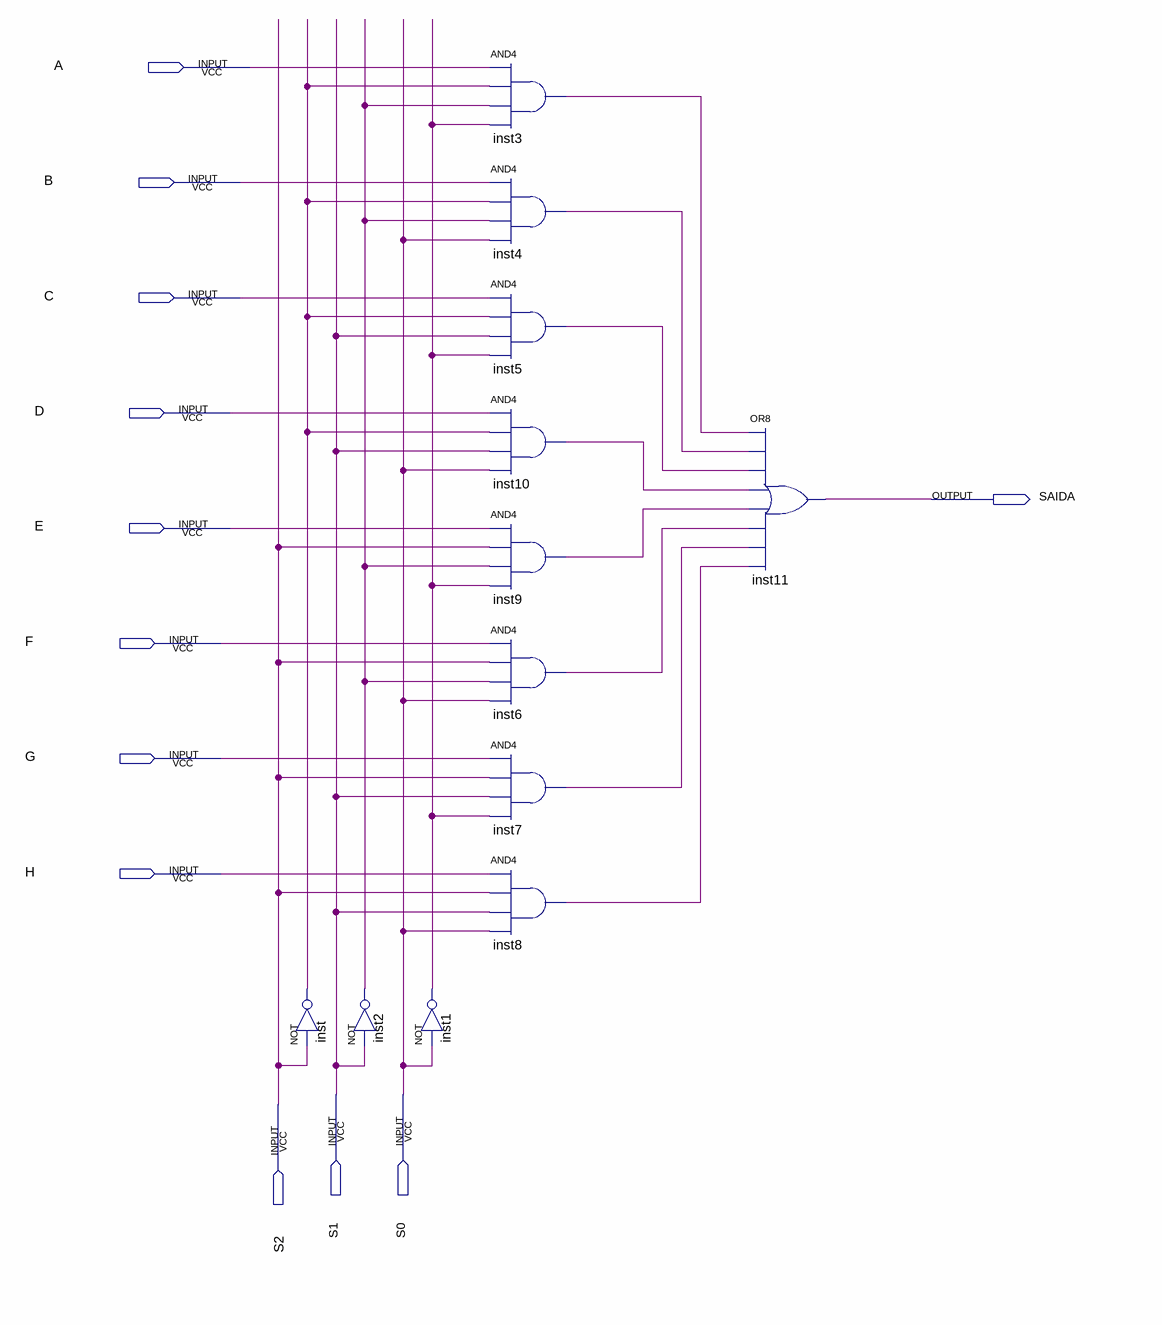
[diagram p0: schematic sheet]
// Quartus schematic Mux8x1_1bit.bdf as structural Verilog: 12 symbols, 12 pins
module Mux8x1_1bit (
  input  A,
  input  B,
  input  C,
  input  D,
  input  E,
  input  F,
  input  G,
  input  H,
  input  S1,
  input  S0,
  input  S2,
  output SAIDA
);

  wire inst1_out, inst2_out, inst3_out, inst4_out, inst5_out, inst6_out, inst7_out, inst8_out, inst9_out,
       inst10_out, inst_out;

  not inst (inst_out, S2);
  not inst2 (inst2_out, S1);
  not inst1 (inst1_out, S0);
  and inst3 (inst3_out, A, inst_out, inst2_out, inst1_out);
  and inst4 (inst4_out, B, inst_out, inst2_out, S0);
  and inst5 (inst5_out, C, inst_out, S1, inst1_out);
  and inst10 (inst10_out, D, inst_out, S1, S0);
  and inst9 (inst9_out, E, S2, inst2_out, inst1_out);
  and inst6 (inst6_out, F, S2, inst2_out, S0);
  and inst7 (inst7_out, G, S2, S1, inst1_out);
  and inst8 (inst8_out, H, S2, S1, S0);
  or inst11 (SAIDA, inst3_out, inst4_out, inst5_out, inst10_out, inst9_out, inst6_out, inst7_out, inst8_out);
endmodule
